# Altium project WiCAN.PrjPcb
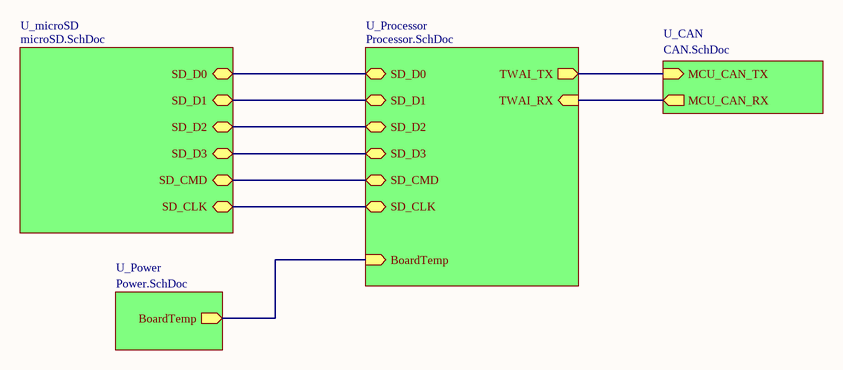
[diagram p0: WiCAN_master.SchDoc]
4 sheets, 28 parts. Net scope: hierarchical (ports join the sheet entries above them; power ports are global).
Board file: WiCAN.PcbDoc
Sheets:
  WiCAN_master.SchDoc
    U_Power = Power.SchDoc
    U_microSD = microSD.SchDoc
    U_CAN = CAN.SchDoc

## Sheet WiCAN_master.SchDoc
size A4; SheetNumber: 1; SheetTotal: 4

### Sub-sheets
U_CAN = CAN.SchDoc: MCU_CAN_TX (in), MCU_CAN_RX (out)
U_microSD = microSD.SchDoc: SD_D0 (bidir), SD_D1 (bidir), SD_D2 (bidir), SD_D3 (bidir), SD_CMD (bidir), SD_CLK (bidir)
U_Power = Power.SchDoc: BoardTemp (out)
U_Processor = Processor.SchDoc (file not in this document): SD_D0 (bidir), SD_D1 (bidir), SD_D2 (bidir), SD_D3 (bidir), SD_CMD (bidir), SD_CLK (bidir), TWAI_TX (out), TWAI_RX (in), BoardTemp (in)

### Nets
NetJ2_1: sheet U_Processor/SD_D2, sheet U_microSD/SD_D2
NetJ2_2: sheet U_Processor/SD_D3, sheet U_microSD/SD_D3
NetJ2_3: sheet U_Processor/SD_CMD, sheet U_microSD/SD_CMD
NetJ2_5: sheet U_Processor/SD_CLK, sheet U_microSD/SD_CLK
NetJ2_7: sheet U_Processor/SD_D0, sheet U_microSD/SD_D0
NetJ2_8: sheet U_Processor/SD_D1, sheet U_microSD/SD_D1
NetU3_2: sheet U_Processor/BoardTemp, sheet U_Power/BoardTemp
NetU4_1: sheet U_Processor/TWAI_TX, sheet U_CAN/MCU_CAN_TX
NetU4_4: sheet U_Processor/TWAI_RX, sheet U_CAN/MCU_CAN_RX

## Sheet Power.SchDoc
size A4; SheetNumber: 3; SheetTotal: 5
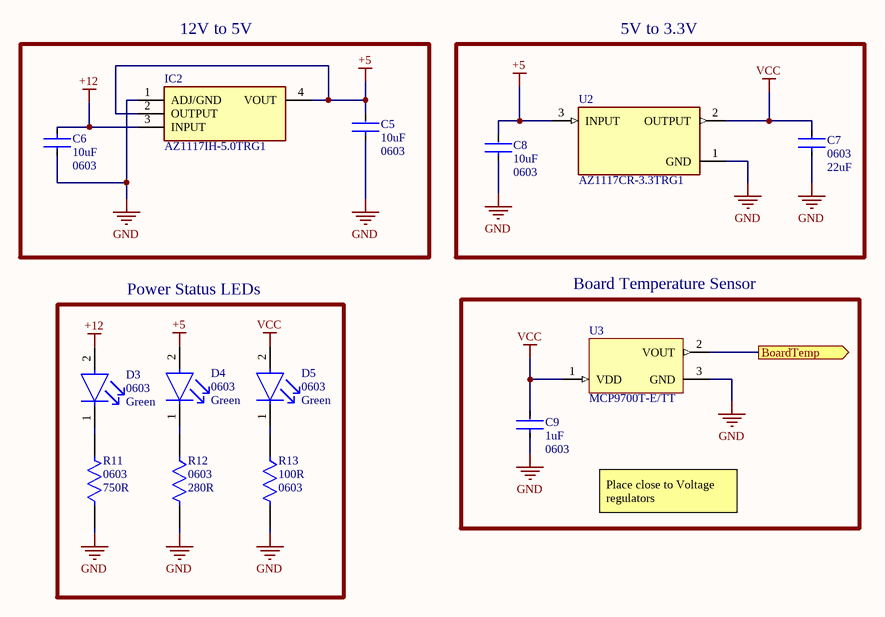
[diagram p1: Power.SchDoc]

### Parts
C5  Capacitance: 10uF  Case/Package: 0603  [FP-CL10-IPC_C]  (hidden comment: CL10A106MQ8NNNC)
C6  Capacitance: 10uF  Case/Package: 0603  [FP-CL10-IPC_C]  (hidden comment: CL10A106MQ8NNNC)
C7  Case/Package: 0603  Capacitance: 22uF  [FP-GRM188-0_2-MFG]  (hidden comment: GRM188R60G226MEA0D)
C8  Capacitance: 10uF  Case/Package: 0603  [FP-CL10-IPC_C]  (hidden comment: CL10A106MQ8NNNC)
C9  Capacitance: 1uF  Case Code (Imperial): 0603  [FP-CL10-IPC_A]  (hidden comment: CL10A105KO8NNNC)
D3  Case Code (Imperial): 0603  Color: Green  [FP-LTST-C190KGKT-MFG]  (hidden comment: 12V)
D4  Case Code (Imperial): 0603  Color: Green  [FP-LTST-C190KGKT-MFG]  (hidden comment: 5V)
D5  Case Code (Imperial): 0603  Color: Green  [FP-LTST-C190KGKT-MFG]  (hidden comment: 3V3)
IC2  AZ1117IH-5.0TRG1  [SOT230P700X170-4N]
R11  Case/Package: 0603  Resistance: 750R  [FP-ESR03-IPC_B]  (hidden comment: ESR03EZPJ751)
R12  Case/Package: 0603  Resistance: 280R  [FP-RMCF0603-MFG]  (hidden comment: RMCF0603FT280R)
R13  Resistance: 100R  Case/Package: 0603  [FP-AC0603-IPC_A]  (hidden comment: AC0603FR-10100RL)
U2  AZ1117CR-3.3TRG1  [FP-SOT89-MFG]
U3  MCP9700T-E/TT  [SOT-23-TT3_M]

### Blocks framed on the sheet
12V to 5V: C5 C6 IC2
5V to 3.3V: C7 C8 U2
Power Status LEDs: D3-D5 R11-R13
Board Temperature Sensor: C9 U3

### Ports
BoardTemp (out)

### Nets
+5: C5.2 C8.2 D4.2(A) IC2.2(OUTPUT) IC2.4(VOUT) U2.3(INPUT)
+12: C6.1 D3.2(A) IC2.3(INPUT)
GND: C5.1 C6.2 C7.1 C8.1 C9.1 IC2.1(ADJ/GND) R11.1 R12.2 R13.2 U2.1(GND) U3.3(GND)
VCC: C7.2 C9.2 D5.2(A) U2.2(OUTPUT) U3.1(VDD)
NetD3_1: D3.1(C) R11.2
NetD4_1: D4.1(C) R12.1
NetD5_1: D5.1(C) R13.1
NetU3_2: U3.2(VOUT) ; port BoardTemp

### Notes on the sheet
- Place close to Voltage regulators

### Library data of the parts
C5 C6 C8 = CMP-13271-001938-1: Cap Ceramic 10uF 6.3V X5R ±20% Pad SMD 0603 +85°C T/R; Contact Plating: Tin; Height: 0.8mm; Width: 0.031inch; Min Operating Temperature: -55°C; Dielectric: X5R; Voltage Rating: 6.3V; Package Quantity: 1; Radiation Hardening: No; Packaging: Tape and Reel; Max Operating Temperature: 85°C; Voltage: 6.3V; Thickness: 0.035inch; Mount: Surface Mount; Case Code (Imperial): 0603; Case Code (Metric): 1608; Depth: 0.8mm; Tolerance: 20%; Length: 1.6mm
C7 = CMP-2006-02788-2: Chip Multilayer Ceramic Capacitors for General Purpose, 0603, 22uF, X5R, 15%, 20%, 4V; Package Quantity: 4000; Lead Free: Lead Free; Material: Ceramic; Height: 0.8mm; Length: 1.6mm; REACH SVHC: No SVHC; Voltage Rating: 4V; Depth: 0.8mm; Case Code (Metric): 1608; Voltage: 4V; Dielectric: X5R; Width: 0.8mm; Max Operating Temperature: 85°C; Tolerance: 20%; Packaging: Tape and Reel; Case Code (Imperial): 0603; Voltage Rating (DC): 4V; Thickness: 0.035inch; Mount: Surface Mount; Min Operating Temperature: -55°C; Radiation Hardening: No; Termination: SMD/SMT
C9 = CMP-13271-001457-1: Cap Ceramic 1uF 16V X5R ±10% Pad SMD 0603 +85°C T/R; Dielectric: X5R; Height: 0.8mm; Mount: Surface Mount; Thickness: 0.035inch; Width: 0.031inch; Min Operating Temperature: -55°C; Contact Plating: Tin; Depth: 0.8mm; Length: 1.6mm; Max Operating Temperature: 85°C; Packaging: Tape and Reel; Tolerance: 10%; Radiation Hardening: No; Case/Package: 0603; Package Quantity: 1; Voltage Rating: 16V; Case Code (Metric): 1608; Voltage: 16V; Material: Ceramic; Lead Free: Lead Free; Voltage Rating (DC): 16V
D3 D5 = CMP-2000-05197-2: LED GREEN CLEAR CHIP SMD; Test Current: 20mA; Power Rating: 75mW; Forward Voltage: 2V; Wavelength: 574nm; Number of LEDs: 1; Reverse Voltage: 5V; Dominant Wavelength: 571nm; Lens Style: Diffused; Luminous Intensity: 35mcd; Forward Current: 30mA; Viewing Angle: 130°; Lens Color: Colorless; Width: 0.8mm; Case Code (Metric): 1608; Number of Pins: 2; Radiation Hardening: No; Package Quantity: 1; Lead Free: Lead Free; Lens Transparency: Clear; Depth: 0.8mm; Power Dissipation: 75mW; Mount: Surface Mount; Max Operating Temperature: 85°C; Case/Package: 0603; Height: 0.8mm; Illumination Color: Green; Length: 1.6mm; Packaging: Tape and Reel; Number of Elements: 1; Min Operating Temperature: -55°C
D4 = CMP-2000-05197-2: LED GREEN CLEAR CHIP SMD; Test Current: 20mA; Power Rating: 75mW; Forward Voltage: 2V; Wavelength: 574nm; Number of LEDs: 1; Dominant Wavelength: 571nm; Lens Style: Diffused; Luminous Intensity: 35mcd; Forward Current: 30mA; Viewing Angle: 130°; Lens Color: Colorless; Width: 0.8mm; Case Code (Metric): 1608; Number of Pins: 2; Radiation Hardening: No; Package Quantity: 1; Lead Free: Lead Free; Lens Transparency: Clear; Depth: 0.8mm; Power Dissipation: 75mW; Reverse Voltage: 5V; Mount: Surface Mount; Max Operating Temperature: 85°C; Case/Package: 0603; Height: 0.8mm; Illumination Color: Green; Length: 1.6mm; Packaging: Tape and Reel; Number of Elements: 1; Min Operating Temperature: -55°C
IC2 = AZ1117IH-5.0TRG1: Integrated Circuit; Manufacturer_Name: Diodes Inc.; Datasheet Link: https://www.diodes.com/assets/Datasheets/AZ1117I.pdf; Height: 1.7mm; Manufacturer_Part_Number: AZ1117IH-5.0TRG1; Mouser Part Number: 621-AZ1117IH-5.0TRG1; Mouser Price/Stock: https://www.mouser.co.uk/ProductDetail/Diodes-Incorporated/AZ1117IH-5.0TRG1?qs=cpo3%2FpBou2jpUVbxjr50ag%3D%3D; Arrow Part Number: AZ1117IH-5.0TRG1; Arrow Price/Stock: https://www.arrow.com/en/products/az1117ih-5.0trg1/diodes-incorporated?region=nac
R11 = CMP-08839-029062-1: 750Ω ±5% 0.25W 0603 Anti-Surge Chip Resistor AEC-Q200; Max Power Dissipation: 250mW; Temperature Coefficient: 200ppm/°C; Length: 0.063inch; Features: Automotive AEC-Q200; Min Operating Temperature: -55°C; Tolerance: 5%; Case Code (Imperial): 0603; Case Code (Metric): 1608; RoHS Compliant: Yes; Width: 0.032inch; Number of Terminations: 2; Resistor Type: Thick Film; Height - Seated (Max): 0.022inch; Max Operating Temperature: 155°C; Series: ESR; Package Quantity: 1; Packaging: Tape and Reel; Height: 0.022inch
R12 = CMP-26527-006784-1: 280Ω ±1% 0.1W 0603 Thick Film Chip Resistor AEC-Q200 compliant; Max Power Dissipation: 100mW; Temperature Coefficient: 100ppm/°C; RoHS Compliant: Yes; Height: 0.022inch; Resistor Type: Thick Film; Case Code (Metric): 1608; Radiation Hardening: No; Contact Plating: Tin; Series: RMCF; Features: Automotive AEC-Q200; Number of Terminations: 2; Tolerance: 1%; Packaging: Tape and Reel; Max Operating Temperature: 155°C; Min Operating Temperature: -55°C; Length: 0.061inch; Lead Free: Lead Free; Width: 0.031inch; Mount: Surface Mount; Case Code (Imperial): 0603
R13 = CMP-03412-011629-2: RES 100Ω 1.00% 0.1W 0603; Tolerance: 1%; RoHS Compliant: Yes
U2 = CMP-12756-000007-1: IC REG LINEAR 3.3V 800MA SOT89; Manufacturer: Diodes Inc.; Nominal Supply Current: 4mA; Output Type: Fixed; Accuracy Percentage: 1%; Max Junction Temp: +125°C; Max Supply Voltage: 15V; Number Of Outputs: 1; Output Current: 1.35A; Dropout Voltage: 1.2V; Device Class L1: Integrated Circuits (ICs); ComponentLink2URL: https://www.diodes.com/assets/Datasheets/AZ1117C.pdf; Temperature Range High: +125°C; Octopart: https://octopart.com/az1117cr-3.3trg1-diodes+inc.-30954805; Output Voltage: 3.3V; Automotive: No; RoHS: TRUE; Temperature Range Low: -20°C; Package: SOT89; Height: 1.6mm; Mouser Description: DiodesZetex AZ1117CR-3.3TRG1, LDO Regulator, 800mA, 3.3 V, ±1% 3-Pin, SOT-89; Manufacturer Part Number: AZ1117CR-3.3TRG1; ComponentLink2Description: Datasheet; Device Class L2: Power Management ICs; Lead Free: Yes; Device Class L3: Voltage Regulators - Linear; Category: IC; Temperature: -20°C to +125°C; Footprint Url: https://www.diodes.com/assets/Package-Files/SOT89.pdf; Digikey Description: IC REG LINEAR 3.3V 800MA SOT89
U3 = CMP-0192-00220-1: Low-Power Linear Active Thermistor IC, 3-Pin SOT-23, Extended Temperature, Tape and Reel; DatasheetVersion: revE, Apr-2009; PackageVersion: revBB, Aug-2009; PackageReference: SOT-23-TT3; Code_IPC: SOT23-3; PackageDescription: 3-Lead Plastic Small Outline Transistor (TT) [SOT-23]

## Sheet microSD.SchDoc
size A4; SheetNumber: 5; SheetTotal: 5
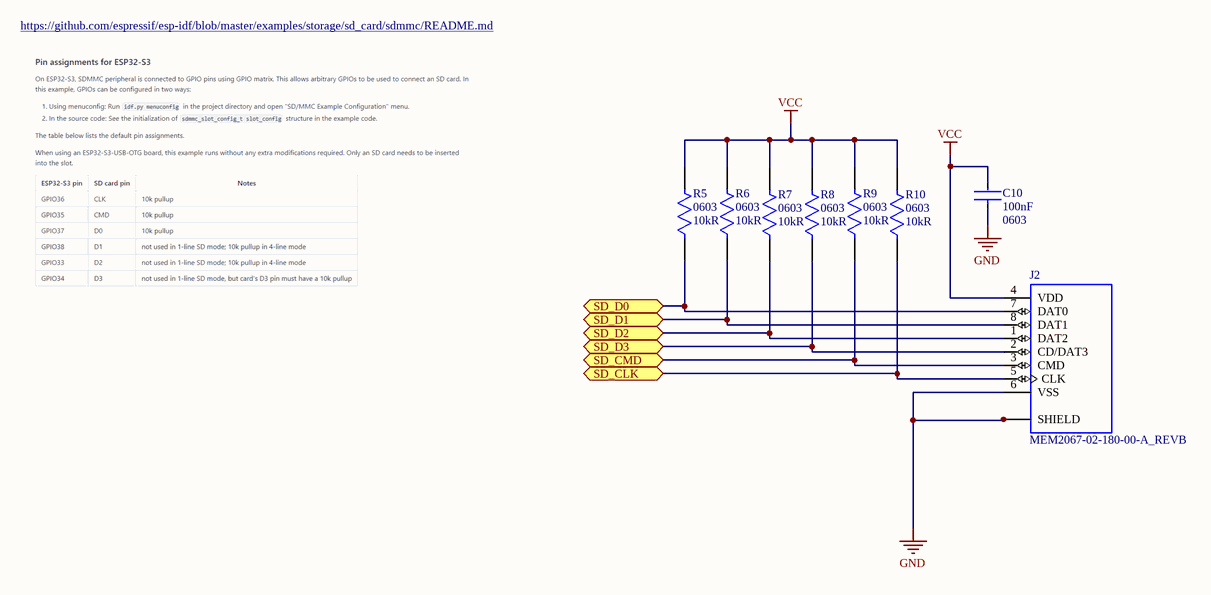
[diagram p2: microSD.SchDoc]

### Parts
C10  Capacitance: 100nF  Case/Package: 0603  [FP-CL10-IPC_A]  (hidden comment: CL10B104KB8WPNC)
J2  MEM2067-02-180-00-A_REVB  [GCT_MEM2067-02-180-00-A_REVB]
R5  Case Code (Imperial): 0603  Resistance: 10kR  [FP-RMCF0603-MFG]  (hidden comment: RMCF0603JG10K0)
R6  Case Code (Imperial): 0603  Resistance: 10kR  [FP-RMCF0603-MFG]  (hidden comment: RMCF0603JG10K0)
R7  Case Code (Imperial): 0603  Resistance: 10kR  [FP-RMCF0603-MFG]  (hidden comment: RMCF0603JG10K0)
R8  Case Code (Imperial): 0603  Resistance: 10kR  [FP-RMCF0603-MFG]  (hidden comment: RMCF0603JG10K0)
R9  Case Code (Imperial): 0603  Resistance: 10kR  [FP-RMCF0603-MFG]  (hidden comment: RMCF0603JG10K0)
R10  Case Code (Imperial): 0603  Resistance: 10kR  [FP-RMCF0603-MFG]  (hidden comment: RMCF0603JG10K0)

### Ports
SD_CLK (bidir), SD_CMD (bidir), SD_D0 (bidir), SD_D1 (bidir), SD_D2 (bidir), SD_D3 (bidir)

### Nets
GND: C10.1 J2.6(VSS) J2.9(SHIELD) J2.10(SHIELD) J2.11(SHIELD) J2.12(SHIELD)
VCC: C10.2 J2.4(VDD) R5.2 R6.2 R7.2 R8.2 R9.2 R10.2
NetJ2_1: J2.1(DAT2) R7.1 ; port SD_D2
NetJ2_2: J2.2(CD/DAT3) R8.1 ; port SD_D3
NetJ2_3: J2.3(CMD) R9.1 ; port SD_CMD
NetJ2_5: J2.5(CLK) R10.1 ; port SD_CLK
NetJ2_7: J2.7(DAT0) R5.1 ; port SD_D0
NetJ2_8: J2.8(DAT1) R6.1 ; port SD_D1

### Notes on the sheet
- https://github.com/espressif/esp-idf/blob/master/examples/storage/sd_card/sdmmc/README.md

### Library data of the parts
C10 = CMP-13271-002353-1: Cap Ceramic 100nF 50V X7R ±10% Pad SMD 0603 +125°C T/R; Ratings: AEC-Q200; Features: Soft Termination; Max Operating Temperature: 125°C; Mount: Surface Mount; Width: 0.031inch; Voltage Rating: 50V; Case Code (Metric): 1608; Case Code (Imperial): 0603; Tolerance: 10%; Min Operating Temperature: -55°C; Thickness: 0.035inch; Lead Free: Lead Free; Packaging: Tape and Reel; Length: 0.063inch
J2 = MEM2067-02-180-00-A_REVB: Micro SD Memory Card ConnectorSMT, Hinged, 1.80mm Profile; Value: *; MP: MEM2067-02-180-00-A_REVB; Package: None; Availability: Unavailable; Price: None
R5-R10 = CMP-26527-000153-1: 10kΩ ±5% 0.1W 0603 Thick Film Chip Resistor AEC-Q200 compliant; Temperature Coefficient: 200ppm/°C; Max Power Dissipation: 100mW; Tolerance: 5%; Series: RMCF; Resistor Type: Thick Film; Length: 0.061inch; Features: Automotive AEC-Q200; Height: 0.022inch; Case Code (Metric): 1608; Width: 0.031inch; Number of Terminations: 2; Contact Plating: Tin; Case/Package: 0603; Package Quantity: 1; Max Operating Temperature: 155°C; Mount: Surface Mount; RoHS Compliant: Yes; Radiation Hardening: No; Min Operating Temperature: -55°C; Packaging: Tape and Reel

## Sheet CAN.SchDoc
size A4; SheetNumber: 4; SheetTotal: 5
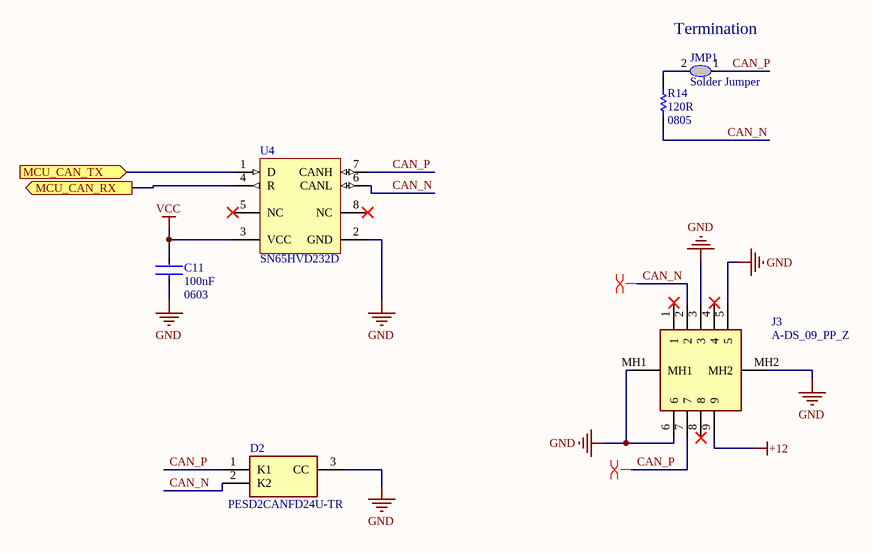
[diagram p3: CAN.SchDoc]

### Parts
C11  Capacitance: 100nF  Case/Package: 0603  [FP-CL10-IPC_A]  (hidden comment: CL10B104KB8WPNC)
D2  PESD2CANFD24U-TR  [SOT95P230X110-3N]
J3  A-DS_09_PP_Z  [ADS09PPZ]
JMP1  Solder Jumper  [Solder Jumper]
R14  Resistance: 120R  Package: 0805  [RESC2013X70X40LL20T20]  (hidden comment: ERJ-P06J121V)
U4  SN65HVD232D  [D0008A_L]

### Ports
MCU_CAN_RX (out), MCU_CAN_TX (in)

### Nets
+12: J3.9
GND: C11.1 D2.3(CC) J3.3 J3.5 J3.6 J3.MH1 J3.MH2 U4.2(GND)
VCC: C11.2 U4.3(VCC)
CAN_N: D2.2(K2) J3.2 R14.2 U4.6(CANL)
CAN_P: D2.1(K1) J3.7 JMP1.1 U4.7(CANH)
NetJMP1_2: JMP1.2 R14.1
NetU4_1: U4.1(D) ; port MCU_CAN_TX
NetU4_4: U4.4(R) ; port MCU_CAN_RX

Not connected (* = marked no-connect by the designer): J3 1* 4* 8*; U4 5(NC)* 8(NC)*

### Layout directives
differential pair: CAN_N, CAN_P

### Notes on the sheet
- Termination

### Library data of the parts
C11 = CMP-13271-002353-1: as C10 on sheet microSD; Ratings: AEC-Q200; Features: Soft Termination; Max Operating Temperature: 125°C; Mount: Surface Mount; Width: 0.031inch; Voltage Rating: 50V; Case Code (Metric): 1608; Case Code (Imperial): 0603; Tolerance: 10%; Min Operating Temperature: -55°C; Thickness: 0.035inch; Lead Free: Lead Free; Packaging: Tape and Reel; Length: 0.063inch
D2 = PESD2CANFD24U-TR: Diode; Manufacturer_Name: Nexperia; Datasheet Link: https://assets.nexperia.com/documents/data-sheet/PESD2CANFD24U-T.pdf; Height: 1.1mm; Manufacturer_Part_Number: PESD2CANFD24U-TR; Mouser Part Number: 771-PESD2CANFD24U-TR; Mouser Price/Stock: https://www.mouser.co.uk/ProductDetail/Nexperia/PESD2CANFD24U-TR?qs=vmHwEFxEFR%252BPr2so13o7KA%3D%3D; Arrow Part Number: PESD2CANFD24U-TR; Arrow Price/Stock: https://www.arrow.com/en/products/pesd2canfd24u-tr/nexperia
J3 = A-DS_09_PP_Z: Connector; Manufacturer_Name: ASSMANN WSW components GmbH; Manufacturer_Part_Number: A-DS 09 PP/Z; Datasheet Link: https://datasheet.datasheetarchive.com/originals/distributors/DKDS-12/220555.pdf; Height: 12.35mm
R14 = CMP-2001-00481-1: Manufacturer: Panasonic; Part Number: ERJ-P06J121V
U4 = CMP-0315-00073-2: 3.3 V CAN Transceiver, 17 mA, -40 to 85 degC, 8-pin SOIC (D), Green (RoHS & no Sb/Br); Manufacturer: Texas Instruments; Supply Voltage(s)(V): 3.3; Transient Pulse Protection(V): -25 to 25; ICC(Max)(mA): 17; Drivers Per Package: 1; Rating: Catalog; Code_JEDEC: MS-012AA; Mounting Technology: Surface Mount; PackageDescription: 8-Pin Plastic Small Outline Integrated Circuit, 4.9 x 3.9 mm, Pitch 1.27 mm Pitch; SubFamily: CAN; PackageVersion: revM, Jun-2011; Isolated: No; DatasheetVersion: SLOS346K; PackageReference: D0008A; Receivers Per Package: 1; Footprint: SN65HVD232; ComponentLink1Description: Datasheet; PartNumber: SN65HVD232D; Eco-Plan: Green (RoHS & no Sb/Br); ComponentLink1URL: http://www.ti.com/general/docs/lit/getliterature.tsp?genericPartNumber=SN65HVD232&fileType=pdf

## Nets that join several sheets
+12: Power (C6.1 D3.2 IC2.3), CAN (J3.9)
GND: Power (11 pins), microSD (6 pins), CAN (8 pins)
VCC: Power (5 pins), microSD (8 pins), CAN (C11.2 U4.3)